# Altium schematic sheet Cover Page.SchDoc: Cover Page
size A4; Author: DODANHLUONG; Revision: 1.0; SheetNumber: 1; SheetTotal: 4; ProjectTitle: KIT ARDUINO VERSION 1.0
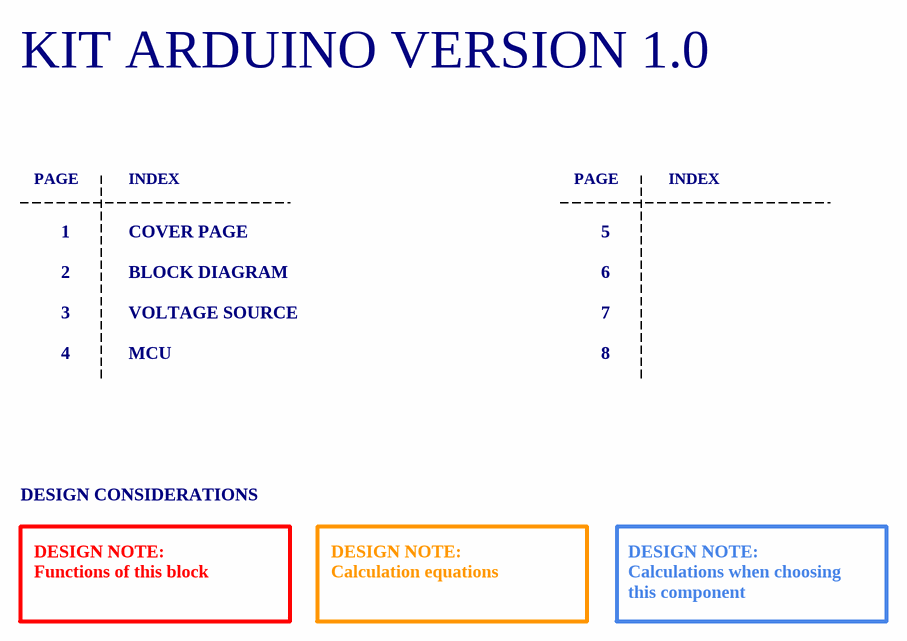
[diagram p0: Cover Page.SchDoc]

## Notes on the sheet
- KIT ARDUINO VERSION 1.0
- PAGE
- 1
- INDEX
- COVER PAGE
- 5
- 2
- BLOCK DIAGRAM
- 6
- 3
- 4
- VOLTAGE SOURCE
- MCU
- 7
- 8
- DESIGN CONSIDERATIONS
- DESIGN NOTE:
  Functions of this block
- DESIGN NOTE:
  Calculation equations
- DESIGN NOTE:
  Calculations when choosing this component
- Author:
- Title:
- Size:
- A4
- Project:
- Approved:
- Revision:
- Modified Date:
- CONFIDENTIAL
- Date:
- SW Version: